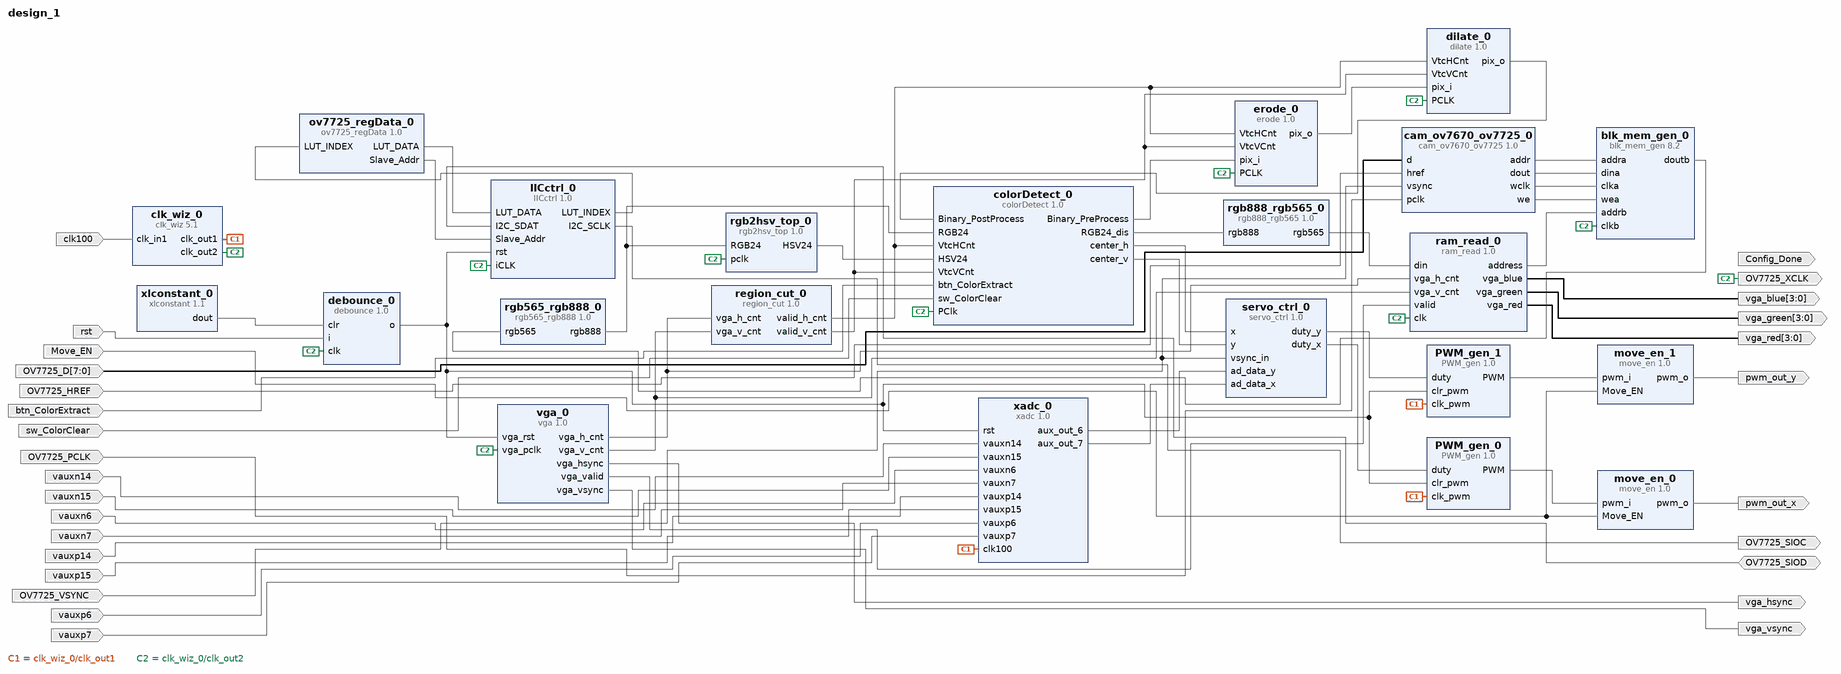
[diagram p0: block diagram of the top level]
# Vivado block design design_1, Vivado 2014.4
create_bd_design design_1

create_bd_port -dir O Config_Done
create_bd_port -dir I Move_EN
create_bd_port -dir I -from 7 -to 0 OV7725_D
create_bd_port -dir I OV7725_HREF
create_bd_port -dir I OV7725_PCLK
create_bd_port -dir O OV7725_SIOC
create_bd_port -dir IO OV7725_SIOD
create_bd_port -dir I OV7725_VSYNC
create_bd_port -dir O OV7725_XCLK
create_bd_port -dir I btn_ColorExtract
create_bd_port -dir I -type clk clk100
create_bd_port -dir O pwm_out_x
create_bd_port -dir O pwm_out_y
create_bd_port -dir I rst
create_bd_port -dir I sw_ColorClear
create_bd_port -dir I vauxn6
create_bd_port -dir I vauxn7
create_bd_port -dir I vauxn14
create_bd_port -dir I vauxn15
create_bd_port -dir I vauxp6
create_bd_port -dir I vauxp7
create_bd_port -dir I vauxp14
create_bd_port -dir I vauxp15
create_bd_port -dir O -from 3 -to 0 vga_blue
create_bd_port -dir O -from 3 -to 0 vga_green
create_bd_port -dir O vga_hsync
create_bd_port -dir O -from 3 -to 0 vga_red
create_bd_port -dir O vga_vsync

create_bd_cell -type ip -vlnv xilinx.com:XUP:IICctrl:1.0 IICctrl_0
create_bd_cell -type ip -vlnv xilinx.com:XUP:PWM_gen:1.0 PWM_gen_0
create_bd_cell -type ip -vlnv xilinx.com:XUP:PWM_gen:1.0 PWM_gen_1
create_bd_cell -type ip -vlnv xilinx.com:ip:blk_mem_gen:8.2 blk_mem_gen_0
set_property -dict [list \
  CONFIG.Memory_Type Simple_Dual_Port_RAM \
  CONFIG.Enable_32bit_Address false \
  CONFIG.Use_Byte_Write_Enable false \
  CONFIG.Write_Width_A 16 \
  CONFIG.Write_Depth_A 76800 \
  CONFIG.Operating_Mode_A NO_CHANGE \
  CONFIG.Enable_A Always_Enabled \
  CONFIG.Write_Width_B 16 \
  CONFIG.Read_Width_B 16 \
  CONFIG.Enable_B Always_Enabled \
  CONFIG.Register_PortB_Output_of_Memory_Primitives true \
  CONFIG.Port_B_Clock 100 \
  CONFIG.Port_B_Enable_Rate 100 \
  CONFIG.use_bram_block Stand_Alone \
] [get_bd_cells blk_mem_gen_0]
create_bd_cell -type ip -vlnv xilinx.com:XUP:cam_ov7670_ov7725:1.0 cam_ov7670_ov7725_0
create_bd_cell -type ip -vlnv xilinx.com:ip:clk_wiz:5.1 clk_wiz_0
set_property -dict [list \
  CONFIG.CLKOUT2_USED true \
  CONFIG.NUM_OUT_CLKS 2 \
  CONFIG.CLKOUT1_REQUESTED_OUT_FREQ 100.000 \
  CONFIG.CLKOUT2_REQUESTED_OUT_FREQ 25.000 \
  CONFIG.USE_LOCKED false \
  CONFIG.USE_RESET false \
  CONFIG.CLKOUT1_JITTER 130.958 \
  CONFIG.CLKOUT2_JITTER 175.402 \
  CONFIG.CLKOUT2_PHASE_ERROR 98.575 \
] [get_bd_cells clk_wiz_0]
create_bd_cell -type ip -vlnv xilinx.com:XUP:colorDetect:1.0 colorDetect_0
create_bd_cell -type ip -vlnv xilinx.com:XUP:debounce:1.0 debounce_0
create_bd_cell -type ip -vlnv xilinx.com:XUP:dilate:1.0 dilate_0
create_bd_cell -type ip -vlnv xilinx.com:XUP:erode:1.0 erode_0
create_bd_cell -type ip -vlnv xilinx.com:XUP:move_en:1.0 move_en_0
create_bd_cell -type ip -vlnv xilinx.com:XUP:move_en:1.0 move_en_1
create_bd_cell -type ip -vlnv xilinx.com:XUP:ov7725_regData:1.0 ov7725_regData_0
create_bd_cell -type ip -vlnv xilinx.com:XUP:ram_read:1.0 ram_read_0
create_bd_cell -type ip -vlnv xilinx.com:XUP:region_cut:1.0 region_cut_0
create_bd_cell -type ip -vlnv xilinx.com:xup:rgb2hsv_top:1.0 rgb2hsv_top_0
create_bd_cell -type ip -vlnv xilinx.com:XUP:rgb565_rgb888:1.0 rgb565_rgb888_0
create_bd_cell -type ip -vlnv xilinx.com:XUP:rgb888_rgb565:1.0 rgb888_rgb565_0
create_bd_cell -type ip -vlnv xilinx.com:XUP:servo_ctrl:1.0 servo_ctrl_0
create_bd_cell -type ip -vlnv xilinx.com:XUP:vga:1.0 vga_0
create_bd_cell -type ip -vlnv xilinx.com:XUP:xadc:1.0 xadc_0
create_bd_cell -type ip -vlnv xilinx.com:ip:xlconstant:1.1 xlconstant_0
set_property -dict {CONFIG.CONST_VAL 0} [get_bd_cells xlconstant_0]

# ---- connections ----

connect_bd_net [get_bd_pins IICctrl_0/I2C_SCLK] [get_bd_ports OV7725_SIOC]
connect_bd_net [get_bd_pins IICctrl_0/LUT_INDEX] [get_bd_pins ov7725_regData_0/LUT_INDEX]
connect_bd_net [get_bd_ports Move_EN] [get_bd_pins move_en_0/Move_EN] [get_bd_pins move_en_1/Move_EN]
connect_bd_net [get_bd_ports OV7725_SIOD] [get_bd_pins IICctrl_0/I2C_SDAT]
connect_bd_net [get_bd_ports OV7725_D] [get_bd_pins cam_ov7670_ov7725_0/d]
connect_bd_net [get_bd_ports OV7725_HREF] [get_bd_pins cam_ov7670_ov7725_0/href]
connect_bd_net [get_bd_pins PWM_gen_0/PWM] [get_bd_pins move_en_0/pwm_i]
connect_bd_net [get_bd_pins PWM_gen_1/PWM] [get_bd_pins move_en_1/pwm_i]
connect_bd_net [get_bd_pins blk_mem_gen_0/doutb] [get_bd_pins rgb565_rgb888_0/rgb565]
connect_bd_net [get_bd_ports btn_ColorExtract] [get_bd_pins colorDetect_0/btn_ColorExtract]
connect_bd_net [get_bd_pins cam_ov7670_ov7725_0/addr] [get_bd_pins blk_mem_gen_0/addra]
connect_bd_net [get_bd_pins cam_ov7670_ov7725_0/dout] [get_bd_pins blk_mem_gen_0/dina]
connect_bd_net [get_bd_pins cam_ov7670_ov7725_0/wclk] [get_bd_pins blk_mem_gen_0/clka]
connect_bd_net [get_bd_pins cam_ov7670_ov7725_0/we] [get_bd_pins blk_mem_gen_0/wea]
connect_bd_net -net clk_in1_1 [get_bd_ports clk100] [get_bd_pins clk_wiz_0/clk_in1]
connect_bd_net [get_bd_pins clk_wiz_0/clk_out1] [get_bd_pins PWM_gen_0/clk_pwm] [get_bd_pins PWM_gen_1/clk_pwm] [get_bd_pins xadc_0/clk100]
connect_bd_net [get_bd_pins clk_wiz_0/clk_out2] \
  [get_bd_ports OV7725_XCLK] [get_bd_pins IICctrl_0/iCLK] [get_bd_pins blk_mem_gen_0/clkb] [get_bd_pins colorDetect_0/PClk] \
  [get_bd_pins debounce_0/clk] [get_bd_pins dilate_0/PCLK] [get_bd_pins erode_0/PCLK] [get_bd_pins ram_read_0/clk] \
  [get_bd_pins rgb2hsv_top_0/pclk] [get_bd_pins vga_0/vga_pclk]
connect_bd_net [get_bd_pins colorDetect_0/Binary_PreProcess] [get_bd_pins erode_0/pix_i]
connect_bd_net [get_bd_pins colorDetect_0/RGB24_dis] [get_bd_pins rgb888_rgb565_0/rgb888]
connect_bd_net [get_bd_pins colorDetect_0/center_h] [get_bd_pins servo_ctrl_0/x]
connect_bd_net [get_bd_pins colorDetect_0/center_v] [get_bd_pins servo_ctrl_0/y]
connect_bd_net [get_bd_pins debounce_0/o] \
  [get_bd_pins IICctrl_0/rst] [get_bd_pins PWM_gen_0/clr_pwm] [get_bd_pins PWM_gen_1/clr_pwm] [get_bd_pins vga_0/vga_rst] \
  [get_bd_pins xadc_0/rst]
connect_bd_net [get_bd_pins dilate_0/pix_o] [get_bd_pins colorDetect_0/Binary_PostProcess]
connect_bd_net [get_bd_pins erode_0/pix_o] [get_bd_pins dilate_0/pix_i]
connect_bd_net [get_bd_pins move_en_0/pwm_o] [get_bd_ports pwm_out_x]
connect_bd_net [get_bd_pins move_en_1/pwm_o] [get_bd_ports pwm_out_y]
connect_bd_net [get_bd_pins ov7725_regData_0/LUT_DATA] [get_bd_pins IICctrl_0/LUT_DATA]
connect_bd_net [get_bd_pins ov7725_regData_0/Slave_Addr] [get_bd_pins IICctrl_0/Slave_Addr]
connect_bd_net -net pclk_1 [get_bd_ports OV7725_PCLK] [get_bd_pins cam_ov7670_ov7725_0/pclk]
connect_bd_net [get_bd_pins ram_read_0/address] [get_bd_pins blk_mem_gen_0/addrb]
connect_bd_net [get_bd_pins ram_read_0/vga_blue] [get_bd_ports vga_blue]
connect_bd_net [get_bd_pins ram_read_0/vga_green] [get_bd_ports vga_green]
connect_bd_net [get_bd_pins ram_read_0/vga_red] [get_bd_ports vga_red]
connect_bd_net [get_bd_pins rgb2hsv_top_0/HSV24] [get_bd_pins colorDetect_0/HSV24]
connect_bd_net [get_bd_pins rgb565_rgb888_0/rgb888] [get_bd_pins colorDetect_0/RGB24] [get_bd_pins rgb2hsv_top_0/RGB24]
connect_bd_net [get_bd_pins rgb888_rgb565_0/rgb565] [get_bd_pins ram_read_0/din]
connect_bd_net [get_bd_ports rst] [get_bd_pins debounce_0/i]
connect_bd_net [get_bd_pins servo_ctrl_0/duty_x] [get_bd_pins PWM_gen_0/duty]
connect_bd_net [get_bd_pins servo_ctrl_0/duty_y] [get_bd_pins PWM_gen_1/duty]
connect_bd_net [get_bd_ports sw_ColorClear] [get_bd_pins colorDetect_0/sw_ColorClear]
connect_bd_net -net vauxn14_1 [get_bd_ports vauxn14] [get_bd_pins xadc_0/vauxn14]
connect_bd_net -net vauxn15_1 [get_bd_ports vauxn15] [get_bd_pins xadc_0/vauxn15]
connect_bd_net -net vauxn6_1 [get_bd_ports vauxn6] [get_bd_pins xadc_0/vauxn6]
connect_bd_net -net vauxn7_1 [get_bd_ports vauxn7] [get_bd_pins xadc_0/vauxn7]
connect_bd_net -net vauxp14_1 [get_bd_ports vauxp14] [get_bd_pins xadc_0/vauxp14]
connect_bd_net -net vauxp15_1 [get_bd_ports vauxp15] [get_bd_pins xadc_0/vauxp15]
connect_bd_net -net vauxp6_1 [get_bd_ports vauxp6] [get_bd_pins xadc_0/vauxp6]
connect_bd_net -net vauxp7_1 [get_bd_ports vauxp7] [get_bd_pins xadc_0/vauxp7]
connect_bd_net -net vga_0_Hcnt_signal [get_bd_pins region_cut_0/valid_h_cnt] \
  [get_bd_pins colorDetect_0/VtcHCnt] [get_bd_pins dilate_0/VtcHCnt] [get_bd_pins erode_0/VtcHCnt]
connect_bd_net -net vga_0_Vcnt_signal [get_bd_pins region_cut_0/valid_v_cnt] \
  [get_bd_pins colorDetect_0/VtcVCnt] [get_bd_pins dilate_0/VtcVCnt] [get_bd_pins erode_0/VtcVCnt]
connect_bd_net [get_bd_pins vga_0/vga_h_cnt] [get_bd_pins ram_read_0/vga_h_cnt] [get_bd_pins region_cut_0/vga_h_cnt]
connect_bd_net [get_bd_pins vga_0/vga_hsync] [get_bd_ports vga_hsync]
connect_bd_net [get_bd_pins vga_0/vga_v_cnt] [get_bd_pins ram_read_0/vga_v_cnt] [get_bd_pins region_cut_0/vga_v_cnt]
connect_bd_net [get_bd_pins vga_0/vga_valid] [get_bd_pins ram_read_0/valid]
connect_bd_net [get_bd_pins vga_0/vga_vsync] [get_bd_ports vga_vsync]
connect_bd_net -net vsync_1 [get_bd_ports OV7725_VSYNC] [get_bd_pins cam_ov7670_ov7725_0/vsync] [get_bd_pins servo_ctrl_0/vsync_in]
connect_bd_net [get_bd_pins xadc_0/aux_out_6] [get_bd_pins servo_ctrl_0/ad_data_y]
connect_bd_net [get_bd_pins xadc_0/aux_out_7] [get_bd_pins servo_ctrl_0/ad_data_x]
connect_bd_net [get_bd_pins xlconstant_0/dout] [get_bd_pins debounce_0/clr]

validate_bd_design
save_bd_design
